# EAGLE design scale (EAGLE 9.6.2)
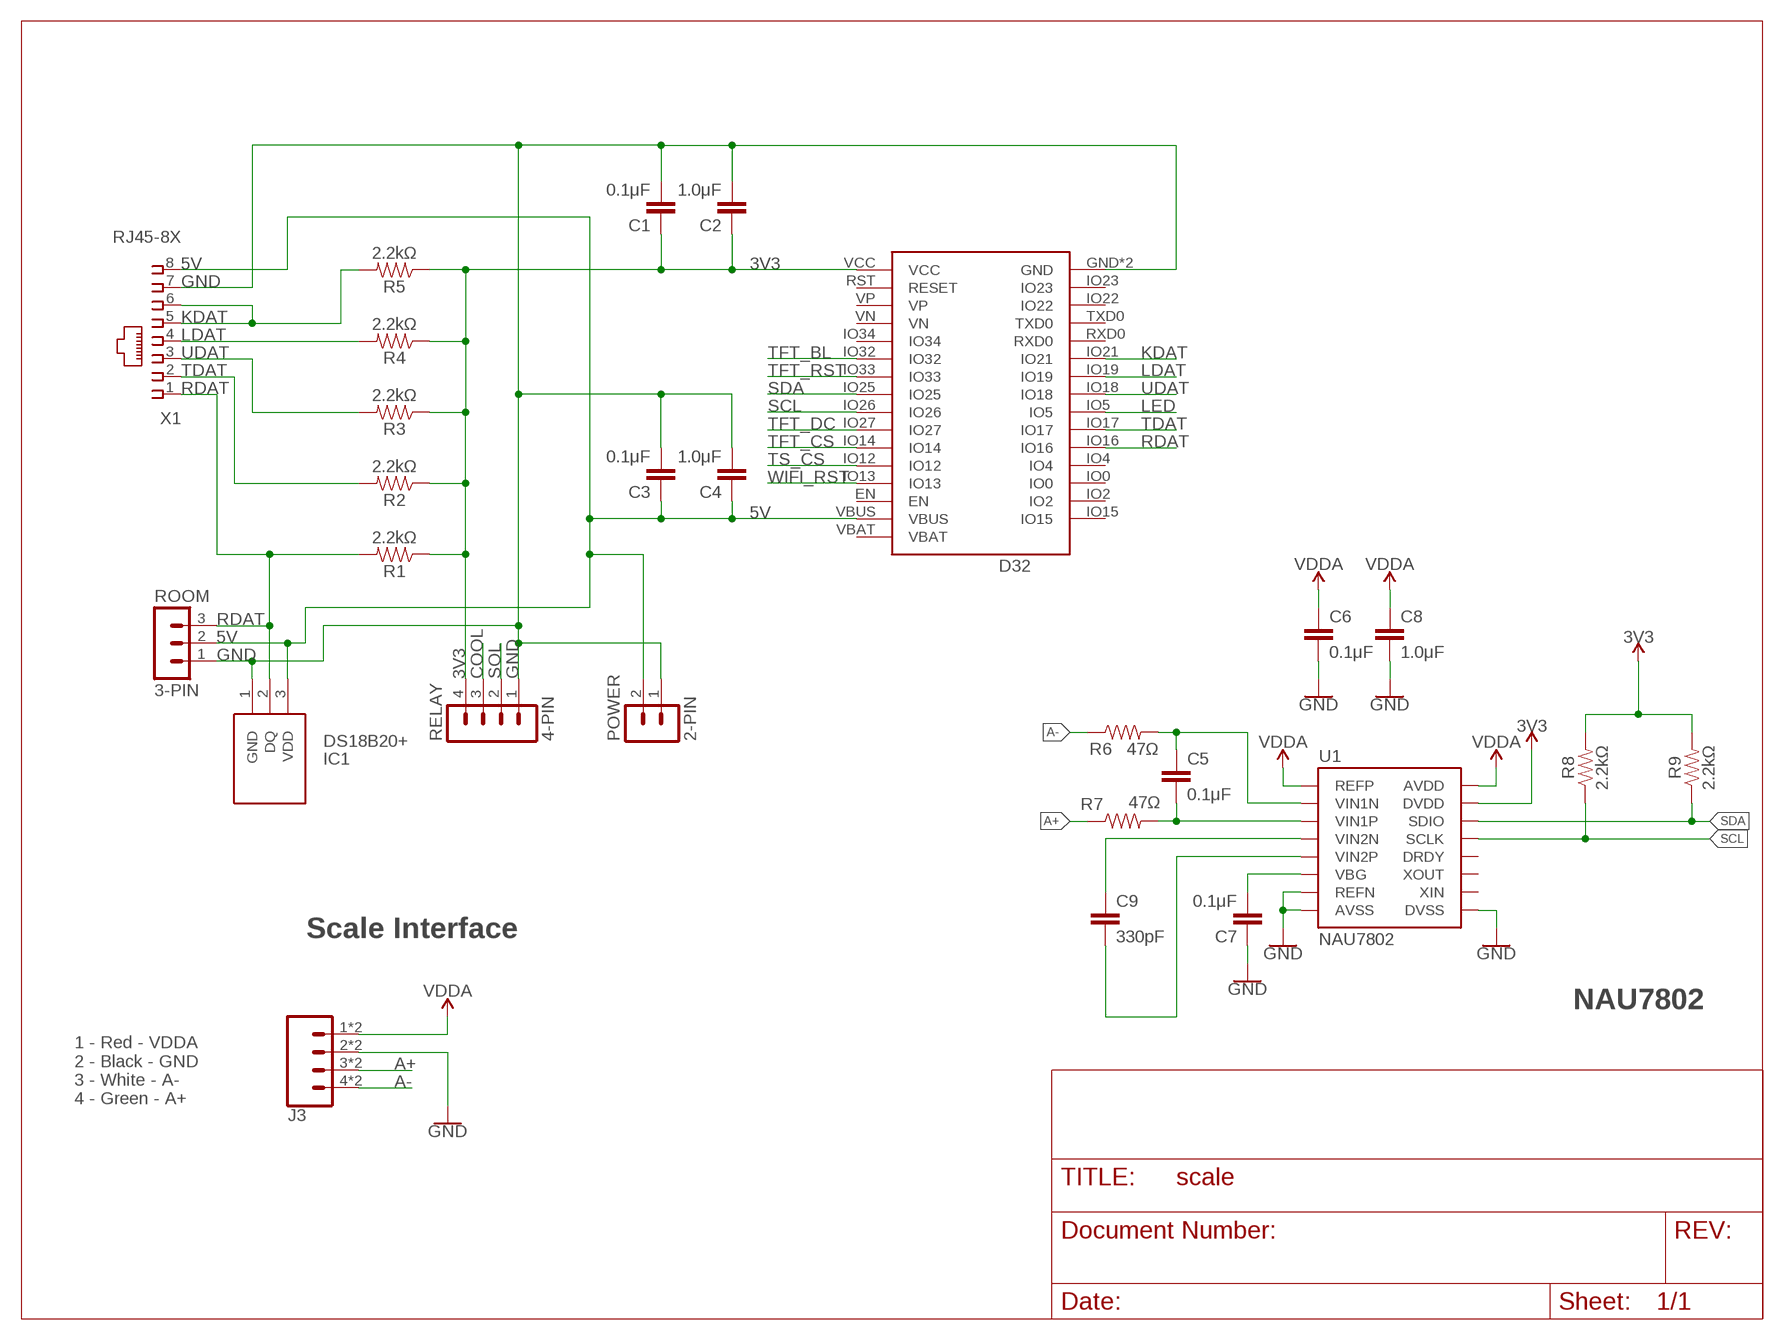
[diagram p0: schematic, sheet 1]

## Parts
C1  0.1μF  CAP_CERAMIC_2.54  [CAP_PTH-2.54]
C2  1.0μF  CAP_CERAMIC_2.54  [CAP_PTH-2.54]
C3  0.1μF  CAP_CERAMIC_2.54  [CAP_PTH-2.54]
C4  1.0μF  CAP_CERAMIC_2.54  [CAP_PTH-2.54]
C5  0.1μF  CAP_CERAMIC_2.54  [CAP_PTH-2.54]
C6  0.1μF  CAP_CERAMIC_2.54  [CAP_PTH-2.54]
C7  0.1μF  CAP_CERAMIC_2.54  [CAP_PTH-2.54]
C8  1.0μF  CAP_CERAMIC_2.54  [CAP_PTH-2.54]
C9  330pF  CAP_CERAMIC_2.54  [CAP_PTH-2.54]
D32  Lolin D32  WEMOS-D32D32_NO_BATT  [D32_NO_BATT]
IC1  DS18B20+  [TO-92]
J3  Spring Terminal  CONN_04SPRING  [1X04_SPRING_TERMINAL]
POWER  2-PIN  HDR-2  [HDR-2_VERT]
R1  2.2kΩ  RESISTORAXIAL-0.3  [AXIAL-0.3]
R2  2.2kΩ  RESISTORAXIAL-0.3  [AXIAL-0.3]
R3  2.2kΩ  RESISTORAXIAL-0.3  [AXIAL-0.3]
R4  2.2kΩ  RESISTORAXIAL-0.3  [AXIAL-0.3]
R5  2.2kΩ  RESISTORAXIAL-0.3  [AXIAL-0.3]
R6  47Ω  1KOHM-HORIZ-1/4W-5%  [AXIAL-0.3]
R7  47Ω  1KOHM-HORIZ-1/4W-5%  [AXIAL-0.3]
R8  2.2kΩ  1KOHM-HORIZ-1/4W-5%  [AXIAL-0.3]
R9  2.2kΩ  1KOHM-HORIZ-1/4W-5%  [AXIAL-0.3]
RELAY  4-PIN  MA04-1  [MA04-1]
ROOM  3-PIN  HDR-3  [HDR-3_VERT]
U1  NAU7802  NAU7802DIP16  [DIP16]
X1  RJ45-8X  [RJ45-NO-SHIELD]

## Nets
3V3 [3v]: C1.1 C2.1 D32.VCC R1.P$1 R2.P$1 R3.P$1 R4.P$1 R5.P$1 R8.P$2 R9.P$2 RELAY.4 U1.15(DVDD) ; supply symbol labelled 3.3V
5V [5v]: C3.1 C4.1 D32.VBUS IC1.3(VDD) POWER.2 ROOM.2 X1.8
A+: J3.3 J3.7 R7.P$1
A-: J3.4 J3.8 R6.P$1
B+: C9.2 U1.5(VIN2P)
COOL: RELAY.3
GND: C1.2 C2.2 C3.2 C4.2 C6.2 C7.1 C8.2 D32.GND D32.GND2(GND) IC1.1(GND) J3.2 J3.6 POWER.1 RELAY.1 ROOM.1 U1.7(REFN) U1.8(AVSS) U1.9(DVSS) X1.7
KDAT: D32.IO21 R5.P$2 X1.5 X1.6
LDAT: D32.IO19 R4.P$2 X1.4
LED: D32.IO5
N$1: C9.1 U1.4(VIN2N)
N$11: C7.2 U1.6(VBG)
N$15: C5.2 R7.P$2 U1.3(VIN1P)
N$16: C5.1 R6.P$2 U1.2(VIN1N)
RDAT: D32.IO16 IC1.2(DQ) R1.P$2 ROOM.3 X1.1
SCL: D32.IO26 R8.P$1 U1.13(SCLK)
SDA: D32.IO25 R9.P$1 U1.14(SDIO)
SOL: RELAY.2
TDAT: D32.IO17 R2.P$2 X1.2
TFT_BL: D32.IO32
TFT_CS: D32.IO14
TFT_DC: D32.IO27
TFT_RST: D32.IO33
TS_CS: D32.IO12
UDAT: D32.IO18 R3.P$2 X1.3
VDDA: C6.1 C8.1 J3.1 J3.5 U1.1(REFP) U1.16(AVDD)
WIFI_RST: D32.IO13
Unconnected: D32.EN D32.IO0 D32.IO2 D32.IO4 D32.IO15 D32.IO22 D32.IO23 D32.IO34 D32.RST(RESET) D32.RXD0 D32.TXD0 D32.VBAT D32.VN D32.VP U1.10(XIN) U1.11(XOUT) U1.12(DRDY)

## Notes on the sheet
- Scale Interface
- NAU7802
- 1 - Red - VDDA
  2 - Black - GND
  3 - White - A-
  4 - Green - A+

## Library data of the parts
C1-C9 = Donnie:CAP_CERAMIC_2.54
D32 = Donnie:WEMOS-D32: D32_REVERSE is a Reverse silkscreen for placing the Wemos D32 on the underside of the board D32_NO-KEEPOUT removes the keepout area beneath the antenna on the D32 and provides a note to avoid components and traces.
IC1 = SamacSys_Parts:DS18B20+: DS18B20 prog thermometer 1-Wire, TO92 Source: Datasheet <http://docs-emea.rs-online.com/webdocs/078b/0900766b8078b130.pdf>; ARROW_PART_NUMBER: DS18B20+; DESCRIPTION: DS18B20 prog thermometer 1-Wire, TO92; HEIGHT: mm; MANUFACTURER_NAME: Maxim Integrated; MANUFACTURER_PART_NUMBER: DS18B20+; MOUSER_PART_NUMBER: 700-DS18B20+; MOUSER_PRICE-STOCK: https://www.mouser.co.uk/ProductDetail/Maxim-Integrated/DS18B20%2b?qs=7H2Jq%252ByxpJKegCKabDbglA%3D%3D
J3 = SparkFun-Connectors:CONN_04: Multi connection point. Often used as Generic Header-pin footprint for 0.1 inch spaced/style header connections On any of the 0.1 inch spaced packages, you can populate with these: Break Away Headers - Straight <https://www.sparkfun.com/products/116> (PRT-00116) Break Away Male Headers - Right Angle <https://www.sparkfun.com/products/553> (PRT-00553) Female Headers <https://www.sparkfun.com/products/115> (PRT-00115) Break Away Headers - Machine Pin <https://www.sparkfun.com/products/117> (PRT-00117) Break Away Female Headers - Swiss Machine Pin <https://www.sparkfun.com/products/743> (PRT-00743) For SCREWTERMINALS and SPRING TERMINALS visit here: Screw Terimnals on SparkFun.com <https://www.sparkfun.com/search/results?term=Screw+Terminals> (5mm/3.5mm/2.54mm spacing) This device is also useful as a general connection point to wire up your design to another part of your project. Our various solder wires solder well into these plated through hole pads. Hook-Up Wire - Assortment (Stranded, 22 AWG) <https://www.sparkfun.com/products/11375> (PRT-11375) Hook-Up Wire - Assortment (Solid Core, 22 AWG) <https://www.sparkfun.com/products/11367> (PRT-11367) View the entire wire category on our website here <https://www.sparkfun.com/categories/141> Special notes: Molex polarized connector foot print use with SKU : PRT-08231 with associated crimp pins and housings. 1MM SMD Version SKU: PRT-10208; SF_ID: PRT-08075
POWER = Donnie:HDR-2
R1-R5 = SparkFun-Resistors:RESISTOR: Generic Resistor Package
R6-R9 = SparkFun-Resistors:1KOHM: 1kΩ resistor A resistor is a passive two-terminal electrical component that implements electrical resistance as a circuit element. Resistors act to reduce current flow, and, at the same time, act to lower voltage levels within circuits. - Wikipedia; PROD_ID: RES-08380; VALUE: 1k
RELAY = Donnie:MA04-1: PIN HEADER; OC_FARNELL: unknown; OC_NEWARK: unknown
ROOM = Donnie:HDR-3: PIN HEADER
U1 = SparkFun-IC-Conversion:NAU7802: 24-bit load cell conversion IC with I2C interface in SOIC-16 package. Similar to HX711 but with true I2C interface.
X1 = con-tycoelectronics:RJ45: CORCOM Modular RJ Jacks No Shield Source: www.tycoelectronics.com .. ENG_DS_1654001_1099_RJ_L_0507.pdf; MPN: RJ45-8X; OC_FARNELL: unknown; OC_NEWARK: 16R6101

## Net classes
0 default: width 0.305 mm, clearance 0.305 mm
1 5v: width 0.406 mm, clearance 0.406 mm
2 3v: width 0.406 mm, clearance 0.406 mm

## Board
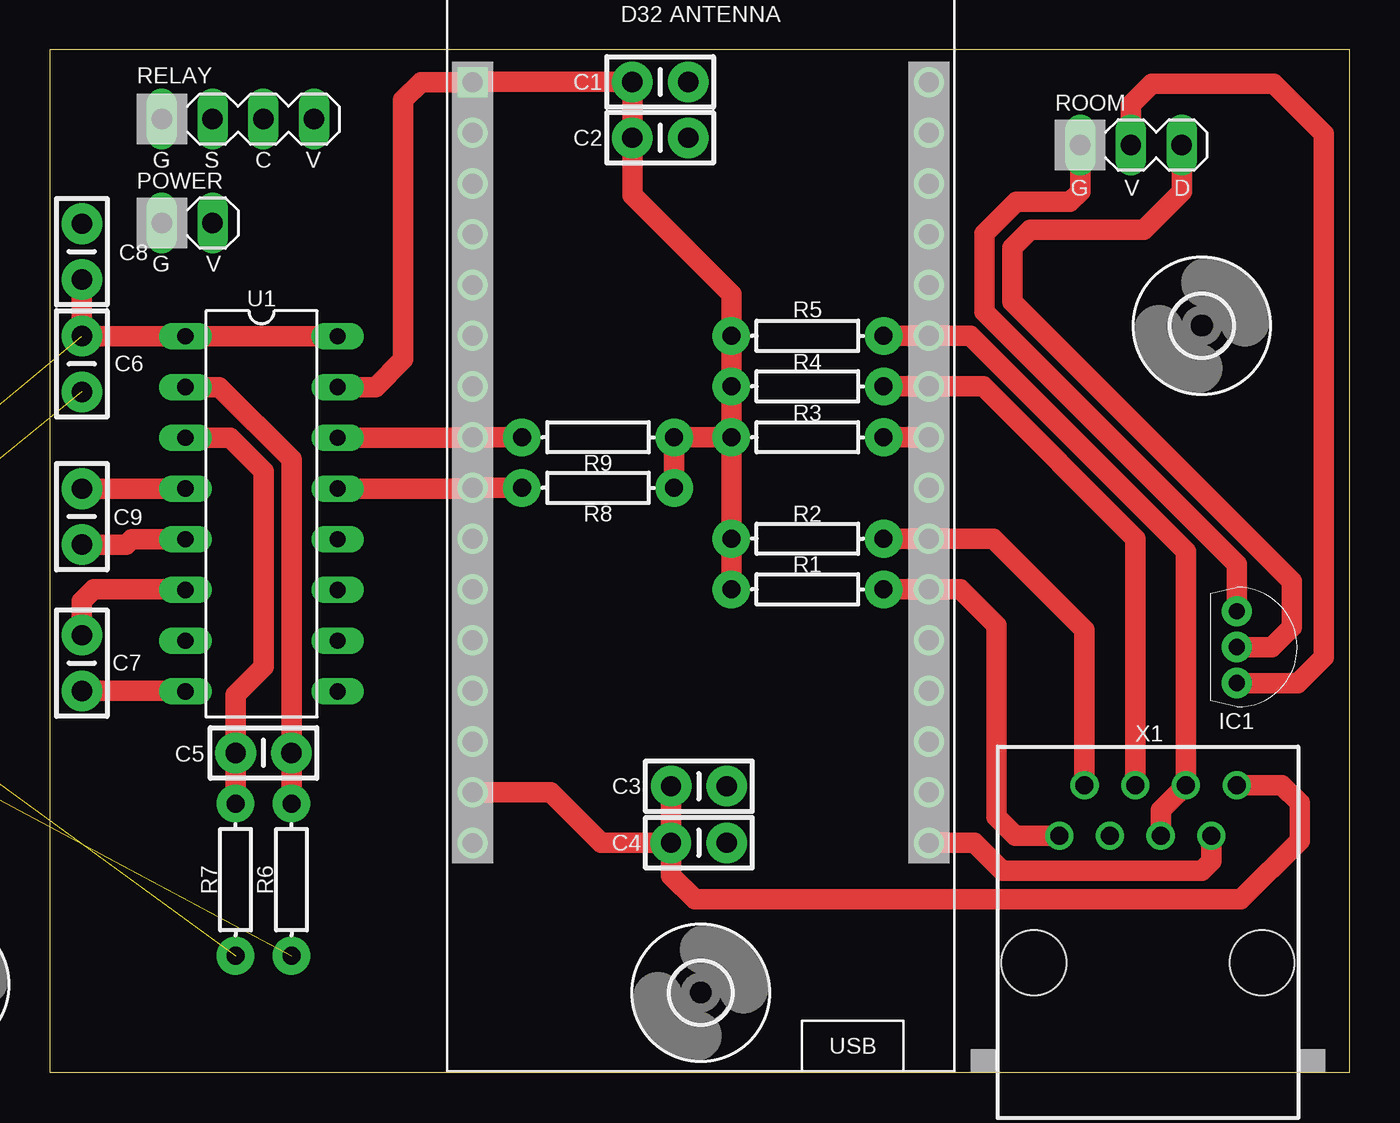
[diagram p1: board, top side]
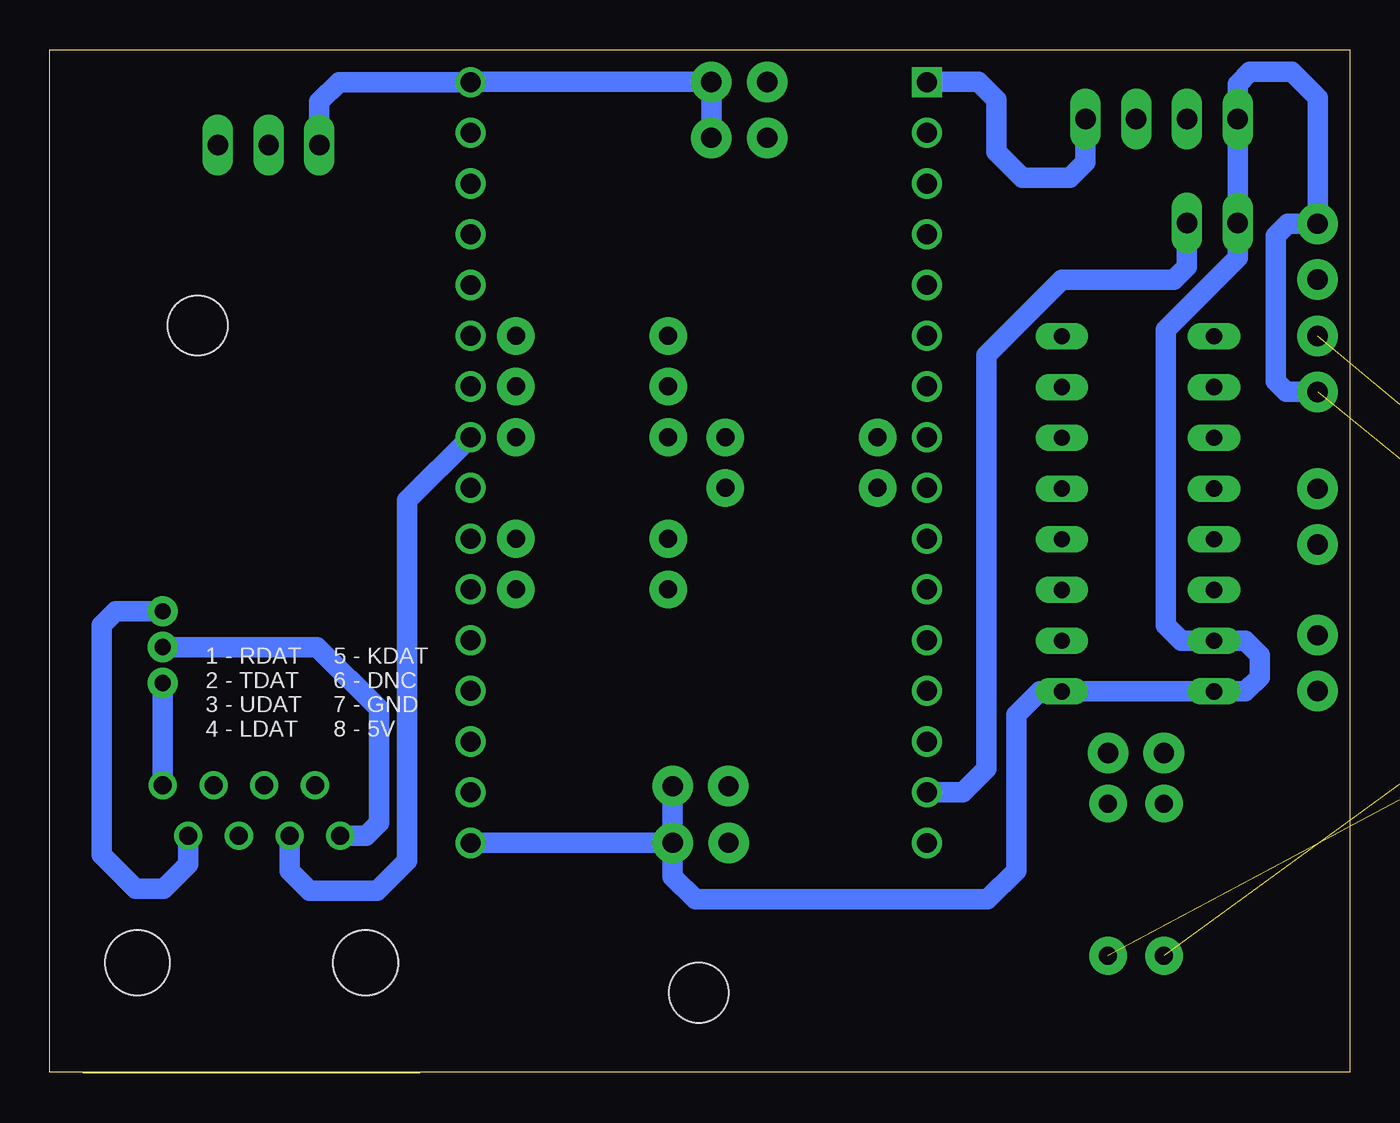
[diagram p2: board, bottom side, seen from below]

Size 65.1 x 51.21 mm. Coordinates in mm from the lower left corner, seen from the top.
Outline: 0,0.01 65.1,0.01 65.1,51.21 0,51.21 0,0.01
Copper layers (1*16): Top 0.035mm / dielectric 1.5mm / Bottom 0.035mm
Design rules "default *": minimum track width 6mil, minimum drill 0.35mm, track to track 6mil, track to pad 6mil, pad to pad 6mil, via to via 6mil, smd to smd 6mil, copper to edge 20mil, drill to drill 6mil, minimum pad ring 10mil, minimum via ring 8mil, stop-mask expansion 4mil, vias tented up to drill 20mil, thermal gap 10mil

### Footprints (pad centres in the part's own frame; a part is rotated, then mirrored left to right if it is on the bottom)
CAP_PTH-2.54 = drill 1.016 pad 2.032: 1 -1.397,0; 2 1.397,0
D32_NO_BATT = drill 1: EN -11.43,-12.7; GND 11.43,20.32; GND2 11.43,-17.78; IO0 11.43,-10.16; IO2 11.43,-12.7; IO4 11.43,-7.62; IO5 11.43,0; IO12 -11.43,-7.62; IO13 -11.43,-10.16; IO14 -11.43,-5.08; IO15 11.43,-15.24; IO16 11.43,-5.08; IO17 11.43,-2.54; IO18 11.43,2.54; IO19 11.43,5.08; IO21 11.43,7.62; IO22 11.43,15.24; IO23 11.43,17.78; IO25 -11.43,2.54; IO26 -11.43,0; IO27 -11.43,-2.54; IO32 -11.43,7.62; IO33 -11.43,5.08; IO34 -11.43,10.16; RST -11.43,17.78; RXD0 11.43,10.16; TXD0 11.43,12.7; VBAT -11.43,-17.78; VBUS -11.43,-15.24; VN -11.43,12.7; VP -11.43,15.24 | drill 1 square: VCC -11.43,20.32
TO-92 = drill 0.81 pad 1.51: 1 0,-1.8; 2 0,0; 3 0,1.8
1X04_SPRING_TERMINAL = drill 1.1 pad 1.8: 1 7.62,2.54; 2 5.08,2.54; 3 2.54,2.54; 4 0,2.54; 5 7.62,-2.54; 6 5.08,-2.54; 7 2.54,-2.54; 8 0,-2.54
HDR-2_VERT = drill 1.016 long: 1 0,0; 2 2.54,0
AXIAL-0.3 = drill 0.9 pad 1.88: P$1 -3.81,0; P$2 3.81,0
MA04-1 = drill 1.016 long: 1 -3.81,0; 2 -1.27,0; 3 1.27,0; 4 3.81,0
HDR-3_VERT = drill 1.016 long: 1 0,0; 2 2.54,0; 3 5.08,0
DIP16 = drill 0.813 long: 1 -8.89,-3.81; 2 -6.35,-3.81; 3 -3.81,-3.81; 4 -1.27,-3.81; 5 1.27,-3.81; 6 3.81,-3.81; 7 6.35,-3.81; 8 8.89,-3.81; 9 8.89,3.81; 10 6.35,3.81; 11 3.81,3.81; 12 1.27,3.81; 13 -1.27,3.81; 14 -3.81,3.81; 15 -6.35,3.81; 16 -8.89,3.81
3,0 = hole 3: 0,0
RJ45-NO-SHIELD = drill 0.9 pad 1.4: 1 -4.445,6.35; 2 -3.175,8.89; 3 -1.905,6.35; 4 -0.635,8.89; 5 0.635,6.35; 6 1.905,8.89; 7 3.175,6.35; 8 4.445,8.89 | hole 3.251: -5.715,0; 5.715,0

### Placement (x,y rotation side)
C1  30.57,49.61 0 top
C2  30.57,46.81 0 top
C3  32.51,14.35 0 top
C4  32.51,11.51 0 top
C5  10.7,16.01 180 top
C6  1.6,35.49 270 top
C7  1.6,20.51 90 top
C8  1.6,41.11 90 top
C9  1.6,27.84 270 top
D32  32.6,29.28 0 top
IC1  59.45,21.31 180 top
J3  -14,18.41 90 top  (outside the outline)
POWER  5.61,42.55 0 top
R1  37.94,24.2 0 top
R2  37.94,26.74 0 top
R3  37.94,31.82 0 top
R4  37.94,34.36 0 top
R5  37.94,36.89 0 top
R6  12.11,9.67 90 top
R7  9.3,9.67 90 top
R8  27.46,29.28 0 top
R9  27.46,31.82 0 top
RELAY  9.42,47.75 0 top
ROOM  51.61,46.45 0 top
U1  10.6,27.98 270 top
U$1  [3,0]  57.7,37.41 0 top
U$2  [3,0]  -5.5,4.41 0 top  (outside the outline)
U$3  [3,0]  32.6,4.01 0 top
X1  55,5.51 0 top

### Tracks (layer width: path | path; a pad name or v marks a point on that pad's centre or on a via)
3V3
  Top 0.406: D32.VCC | R3.P$1
  Top 1.016: R1.P$1 R2.P$1 R3.P$1 R4.P$1 R5.P$1 34.13,38.98 29.17,43.94 C2.1 C1.1 D32.VCC | R8.P$2 R9.P$2 R3.P$1 | U1.15 16.32,34.33 17.7,35.71 17.7,48.71 18.59,49.6 D32.VCC
  Bottom 0.406: D32.VCC
  Bottom 1.016: RELAY.4 13.23,45.58 14,44.81 16.4,44.81 17.7,46.11 17.7,48.71 18.6,49.61 D32.VCC
5V
  Top 0.406: C4.1
  Top 1.016: D32.VBUS 25.07,14.04 27.6,11.51 C4.1 | C3.1 C4.1 31.11,9.87 32.31,8.67 59.66,8.67 62.6,11.61 62.6,13.51 61.71,14.4 X1.8 | IC1.3 62.5,19.51 63.8,20.81 63.8,47.01 61.3,49.51 55.2,49.51 54.15,48.46 ROOM.2
  Bottom 1.016: X1.8 IC1.3 | D32.VBUS 19.37,14.04 18.2,15.21 18.2,35.91 14.4,39.71 8.8,39.71 8.15,40.36 POWER.2
A+  (2 unrouted)
A-  (2 unrouted)
B+
  Top 1.016: C9.2 3.83,26.44 4.1,26.71 U1.5
GND  (2 unrouted)
  Top 0.406: 6.77,19.11 U1.8
  Top 1.016: D32.GND2 46.31,11.5 47.7,10.11 57.7,10.11 58.18,10.59 X1.7 | IC1.1 59.45,25.47 46.8,38.11 46.8,42.01 48.4,43.61 51.1,43.61 51.61,44.12 ROOM.1 | C7.1 6.77,19.11
  Bottom 0.406: C4.2
  Bottom 1.016: C4.2 D32.GND2 | IC1.1 61.8,23.11 62.5,22.41 62.5,10.91 60.8,9.21 59.4,9.21 58.18,10.44 X1.7 | ROOM.1 51.61,48.6 50.61,49.6 D32.GND C1.2 C2.2 | C3.2 C4.2 33.91,9.82 32.77,8.68 18.13,8.68 16.7,10.11 16.7,17.91 15.52,19.09 U1.9 U1.8 5.22,19.09 4.5,19.81 4.5,20.91 5.22,21.63 U1.7 8.42,21.63 9.2,22.41 9.2,37.21 5.61,40.8 POWER.1 RELAY.1 5.61,49.5 5,50.11 2.9,50.11 1.6,48.81 C8.2 3.1,42.51 3.7,41.91 3.7,34.61 3.18,34.09 C6.2
KDAT
  Top 1.016: R5.P$2 D32.IO21 46.11,36.9 56.91,26.11 X1.6 55.63,13.13 X1.5
LDAT
  Top 1.016: R4.P$2 D32.IO19 46.75,34.36 54.37,26.75 X1.4
N$1
  Top 0.406: 6.78,29.24 U1.4
  Top 1.016: C9.1 6.78,29.24
N$11
  Top 0.406: 6.75,24.21 U1.6
  Top 1.016: C7.2 1.6,23.61 2.2,24.21 6.75,24.21
N$15
  Top 0.406: R7.P$2
  Top 1.016: U1.3 9.02,31.79 10.7,30.11 10.7,20.31 9.3,18.91 C5.2 R7.P$2
N$16
  Top 0.406: R6.P$2 12.1,13.48
  Top 1.016: U1.2 8.48,34.33 12.1,30.71 C5.1 12.1,13.48
RDAT
  Top 1.016: R1.P$2 D32.IO16 45.61,24.2 47.4,22.41 47.4,12.81 48.35,11.86 X1.1 | IC1.2 61.2,21.31 62.2,22.31 62.2,24.61 48.79,38.02 48.2,38.61 48.2,41.31 49.1,42.21 54.8,42.21 56.69,44.1 ROOM.3
  Bottom 1.016: X1.1 49.26,11.86 48.61,12.51 48.61,18.21 51.71,21.31 IC1.2
SCL
  Top 0.406: 21.14,29.25 D32.IO26
  Top 1.016: D32.IO26 R8.P$1 | U1.13 21.14,29.25
SDA
  Top 0.406: R9.P$1 | 21.14,31.79 D32.IO25
  Top 1.016: D32.IO25 R9.P$1 | U1.14 21.14,31.79
TDAT
  Top 1.016: R2.P$2 D32.IO17 47.27,26.74 51.83,22.19 X1.2
UDAT
  Top 1.016: R3.P$2 D32.IO18
  Bottom 1.016: D32.IO18 47.2,28.65 47.2,10.61 48.7,9.11 52.1,9.11 53.09,10.11 X1.3
VDDA  (2 unrouted)
  Top 0.406: 1.61,36.87 C6.1
  Top 1.016: U1.16 U1.1 1.61,36.87 | C6.1 C8.1

### Text on the board
tNames: G | S | C | V | G | V | D | G | V
bNames: 5 - KDAT / 6 - DNC / 7 - GND / 8 - 5V | 1 - RDAT / 2 - TDAT / 3 - UDAT / 4 - LDAT